# Altium schematic sheet input4.SchDoc
size A3
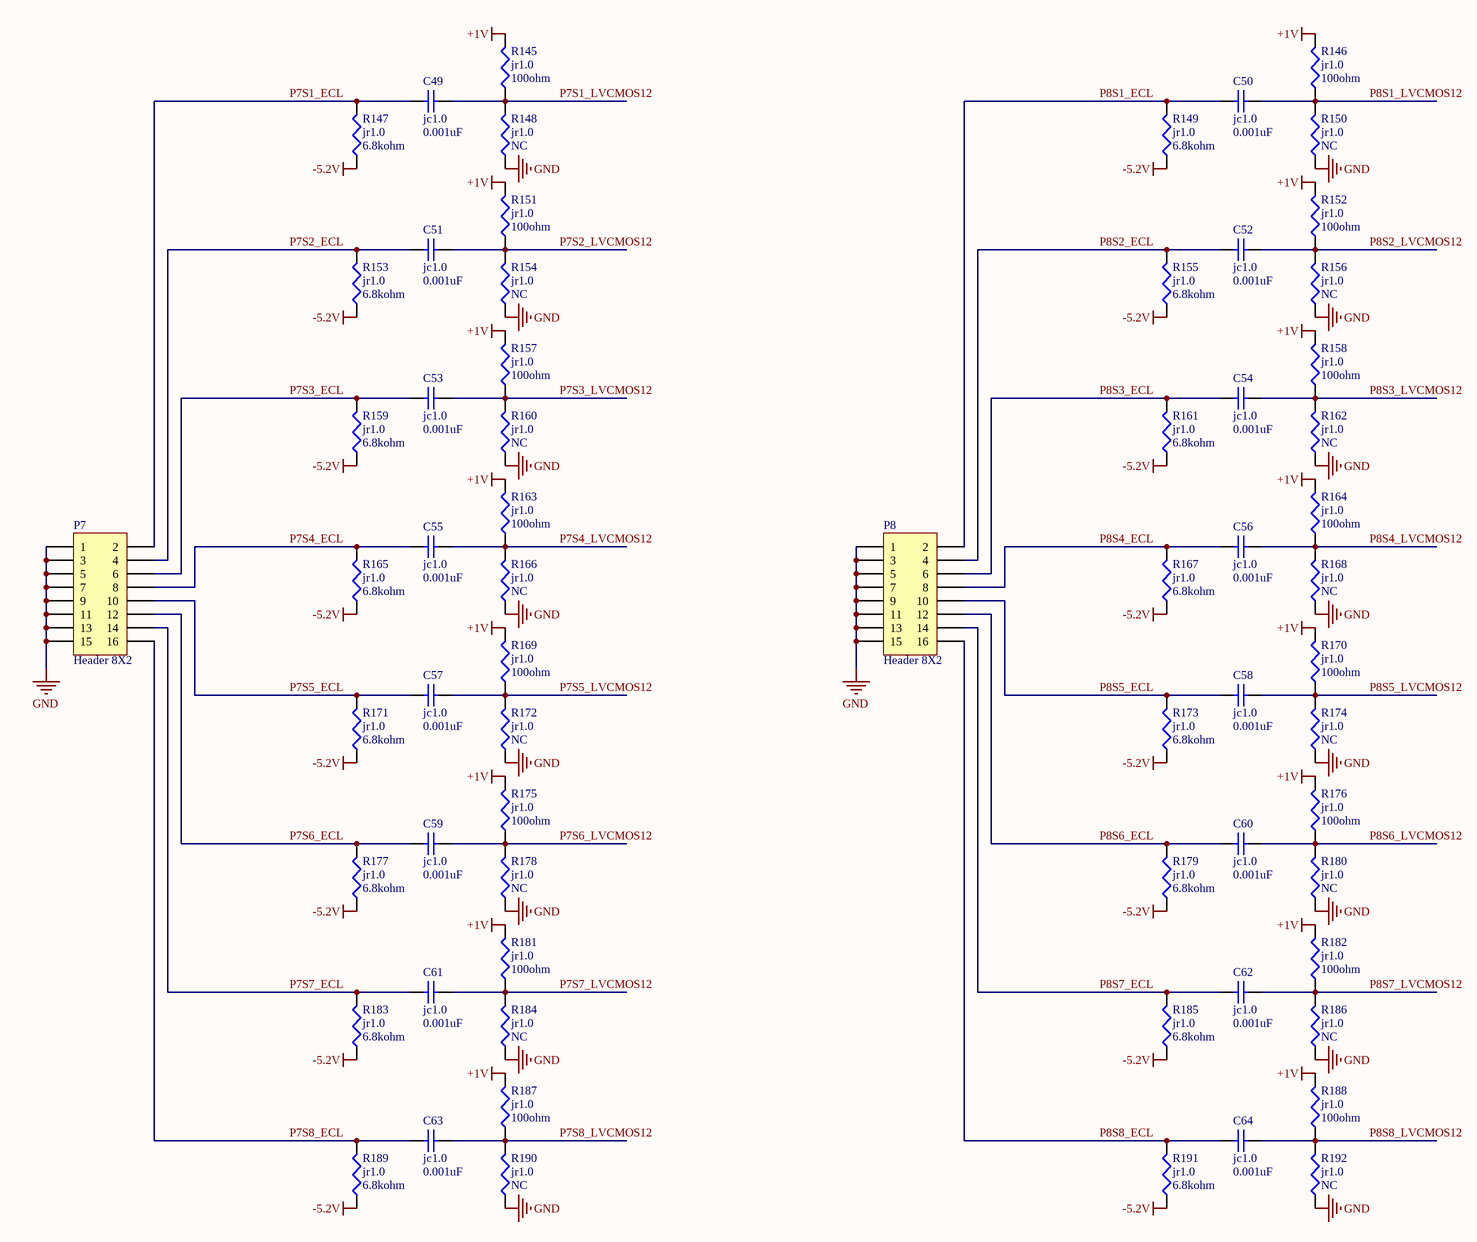
[diagram p0: input4.SchDoc]

## Parts
C49  jc1.0  value 0.001uF  [0402]
C50  jc1.0  value 0.001uF  [0402]
C51  jc1.0  value 0.001uF  [0402]
C52  jc1.0  value 0.001uF  [0402]
C53  jc1.0  value 0.001uF  [0402]
C54  jc1.0  value 0.001uF  [0402]
C55  jc1.0  value 0.001uF  [0402]
C56  jc1.0  value 0.001uF  [0402]
C57  jc1.0  value 0.001uF  [0402]
C58  jc1.0  value 0.001uF  [0402]
C59  jc1.0  value 0.001uF  [0402]
C60  jc1.0  value 0.001uF  [0402]
C61  jc1.0  value 0.001uF  [0402]
C62  jc1.0  value 0.001uF  [0402]
C63  jc1.0  value 0.001uF  [0402]
C64  jc1.0  value 0.001uF  [0402]
P7  Header 8X2  [HDR2X8]
P8  Header 8X2  [HDR2X8]
R145  jr1.0  value 100ohm  [0402]
R146  jr1.0  value 100ohm  [0402]
R147  jr1.0  value 6.8kohm  [0402]
R148  jr1.0  value NC  [0402]
R149  jr1.0  value 6.8kohm  [0402]
R150  jr1.0  value NC  [0402]
R151  jr1.0  value 100ohm  [0402]
R152  jr1.0  value 100ohm  [0402]
R153  jr1.0  value 6.8kohm  [0402]
R154  jr1.0  value NC  [0402]
R155  jr1.0  value 6.8kohm  [0402]
R156  jr1.0  value NC  [0402]
R157  jr1.0  value 100ohm  [0402]
R158  jr1.0  value 100ohm  [0402]
R159  jr1.0  value 6.8kohm  [0402]
R160  jr1.0  value NC  [0402]
R161  jr1.0  value 6.8kohm  [0402]
R162  jr1.0  value NC  [0402]
R163  jr1.0  value 100ohm  [0402]
R164  jr1.0  value 100ohm  [0402]
R165  jr1.0  value 6.8kohm  [0402]
R166  jr1.0  value NC  [0402]
R167  jr1.0  value 6.8kohm  [0402]
R168  jr1.0  value NC  [0402]
R169  jr1.0  value 100ohm  [0402]
R170  jr1.0  value 100ohm  [0402]
R171  jr1.0  value 6.8kohm  [0402]
R172  jr1.0  value NC  [0402]
R173  jr1.0  value 6.8kohm  [0402]
R174  jr1.0  value NC  [0402]
R175  jr1.0  value 100ohm  [0402]
R176  jr1.0  value 100ohm  [0402]
R177  jr1.0  value 6.8kohm  [0402]
R178  jr1.0  value NC  [0402]
R179  jr1.0  value 6.8kohm  [0402]
R180  jr1.0  value NC  [0402]
R181  jr1.0  value 100ohm  [0402]
R182  jr1.0  value 100ohm  [0402]
R183  jr1.0  value 6.8kohm  [0402]
R184  jr1.0  value NC  [0402]
R185  jr1.0  value 6.8kohm  [0402]
R186  jr1.0  value NC  [0402]
R187  jr1.0  value 100ohm  [0402]
R188  jr1.0  value 100ohm  [0402]
R189  jr1.0  value 6.8kohm  [0402]
R190  jr1.0  value NC  [0402]
R191  jr1.0  value 6.8kohm  [0402]
R192  jr1.0  value NC  [0402]

## Nets
+1V: R145.2 R146.2 R151.2 R152.2 R157.2 R158.2 R163.2 R164.2 R169.2 R170.2 R175.2 R176.2 R181.2 R182.2 R187.2 R188.2
-5.2V: R147.1 R149.1 R153.1 R155.1 R159.1 R161.1 R165.1 R167.1 R171.1 R173.1 R177.1 R179.1 R183.1 R185.1 R189.1 R191.1
GND: P7.1 P7.3 P7.5 P7.7 P7.9 P7.11 P7.13 P7.15 P8.1 P8.3 P8.5 P8.7 P8.9 P8.11 P8.13 P8.15 R148.1 R150.1 R154.1 R156.1 R160.1 R162.1 R166.1 R168.1 R172.1 R174.1 R178.1 R180.1 R184.1 R186.1 R190.1 R192.1
P7S1_ECL: C49.1 P7.2 R147.2
P7S1_LVCMOS12: C49.2 R145.1 R148.2
P7S2_ECL: C51.1 P7.4 R153.2
P7S2_LVCMOS12: C51.2 R151.1 R154.2
P7S3_ECL: C53.1 P7.6 R159.2
P7S3_LVCMOS12: C53.2 R157.1 R160.2
P7S4_ECL: C55.1 P7.8 R165.2
P7S4_LVCMOS12: C55.2 R163.1 R166.2
P7S5_ECL: C57.1 P7.10 R171.2
P7S5_LVCMOS12: C57.2 R169.1 R172.2
P7S6_ECL: C59.1 P7.12 R177.2
P7S6_LVCMOS12: C59.2 R175.1 R178.2
P7S7_ECL: C61.1 P7.14 R183.2
P7S7_LVCMOS12: C61.2 R181.1 R184.2
P7S8_ECL: C63.1 P7.16 R189.2
P7S8_LVCMOS12: C63.2 R187.1 R190.2
P8S1_ECL: C50.1 P8.2 R149.2
P8S1_LVCMOS12: C50.2 R146.1 R150.2
P8S2_ECL: C52.1 P8.4 R155.2
P8S2_LVCMOS12: C52.2 R152.1 R156.2
P8S3_ECL: C54.1 P8.6 R161.2
P8S3_LVCMOS12: C54.2 R158.1 R162.2
P8S4_ECL: C56.1 P8.8 R167.2
P8S4_LVCMOS12: C56.2 R164.1 R168.2
P8S5_ECL: C58.1 P8.10 R173.2
P8S5_LVCMOS12: C58.2 R170.1 R174.2
P8S6_ECL: C60.1 P8.12 R179.2
P8S6_LVCMOS12: C60.2 R176.1 R180.2
P8S7_ECL: C62.1 P8.14 R185.2
P8S7_LVCMOS12: C62.2 R182.1 R186.2
P8S8_ECL: C64.1 P8.16 R191.2
P8S8_LVCMOS12: C64.2 R188.1 R192.2

## Library data of the parts
C49-C64 = Cap: Capacitor; Published: 8-Jun-2000; LatestRevisionDate: 17-Jul-2002; LatestRevisionNote: Re-released for DXP Platform.; PackageReference: RAD-0.3; Publisher: Altium Limited
P7 P8 = Header 8X2: Header, 8-Pin, Dual row; LatestRevisionDate: 17-Jul-2002; LatestRevisionNote: Re-released for DXP Platform.; Publisher: Altium Limited
R145-R192 = Res: Resistor; Published: 8-Jun-2000; LatestRevisionDate: 04-Mar-2005; LatestRevisionNote: PCB Footprint replaced.; PackageReference: J1-0603; Publisher: Altium Limited